# EAGLE design fdcanusb (EAGLE 9.6.0)
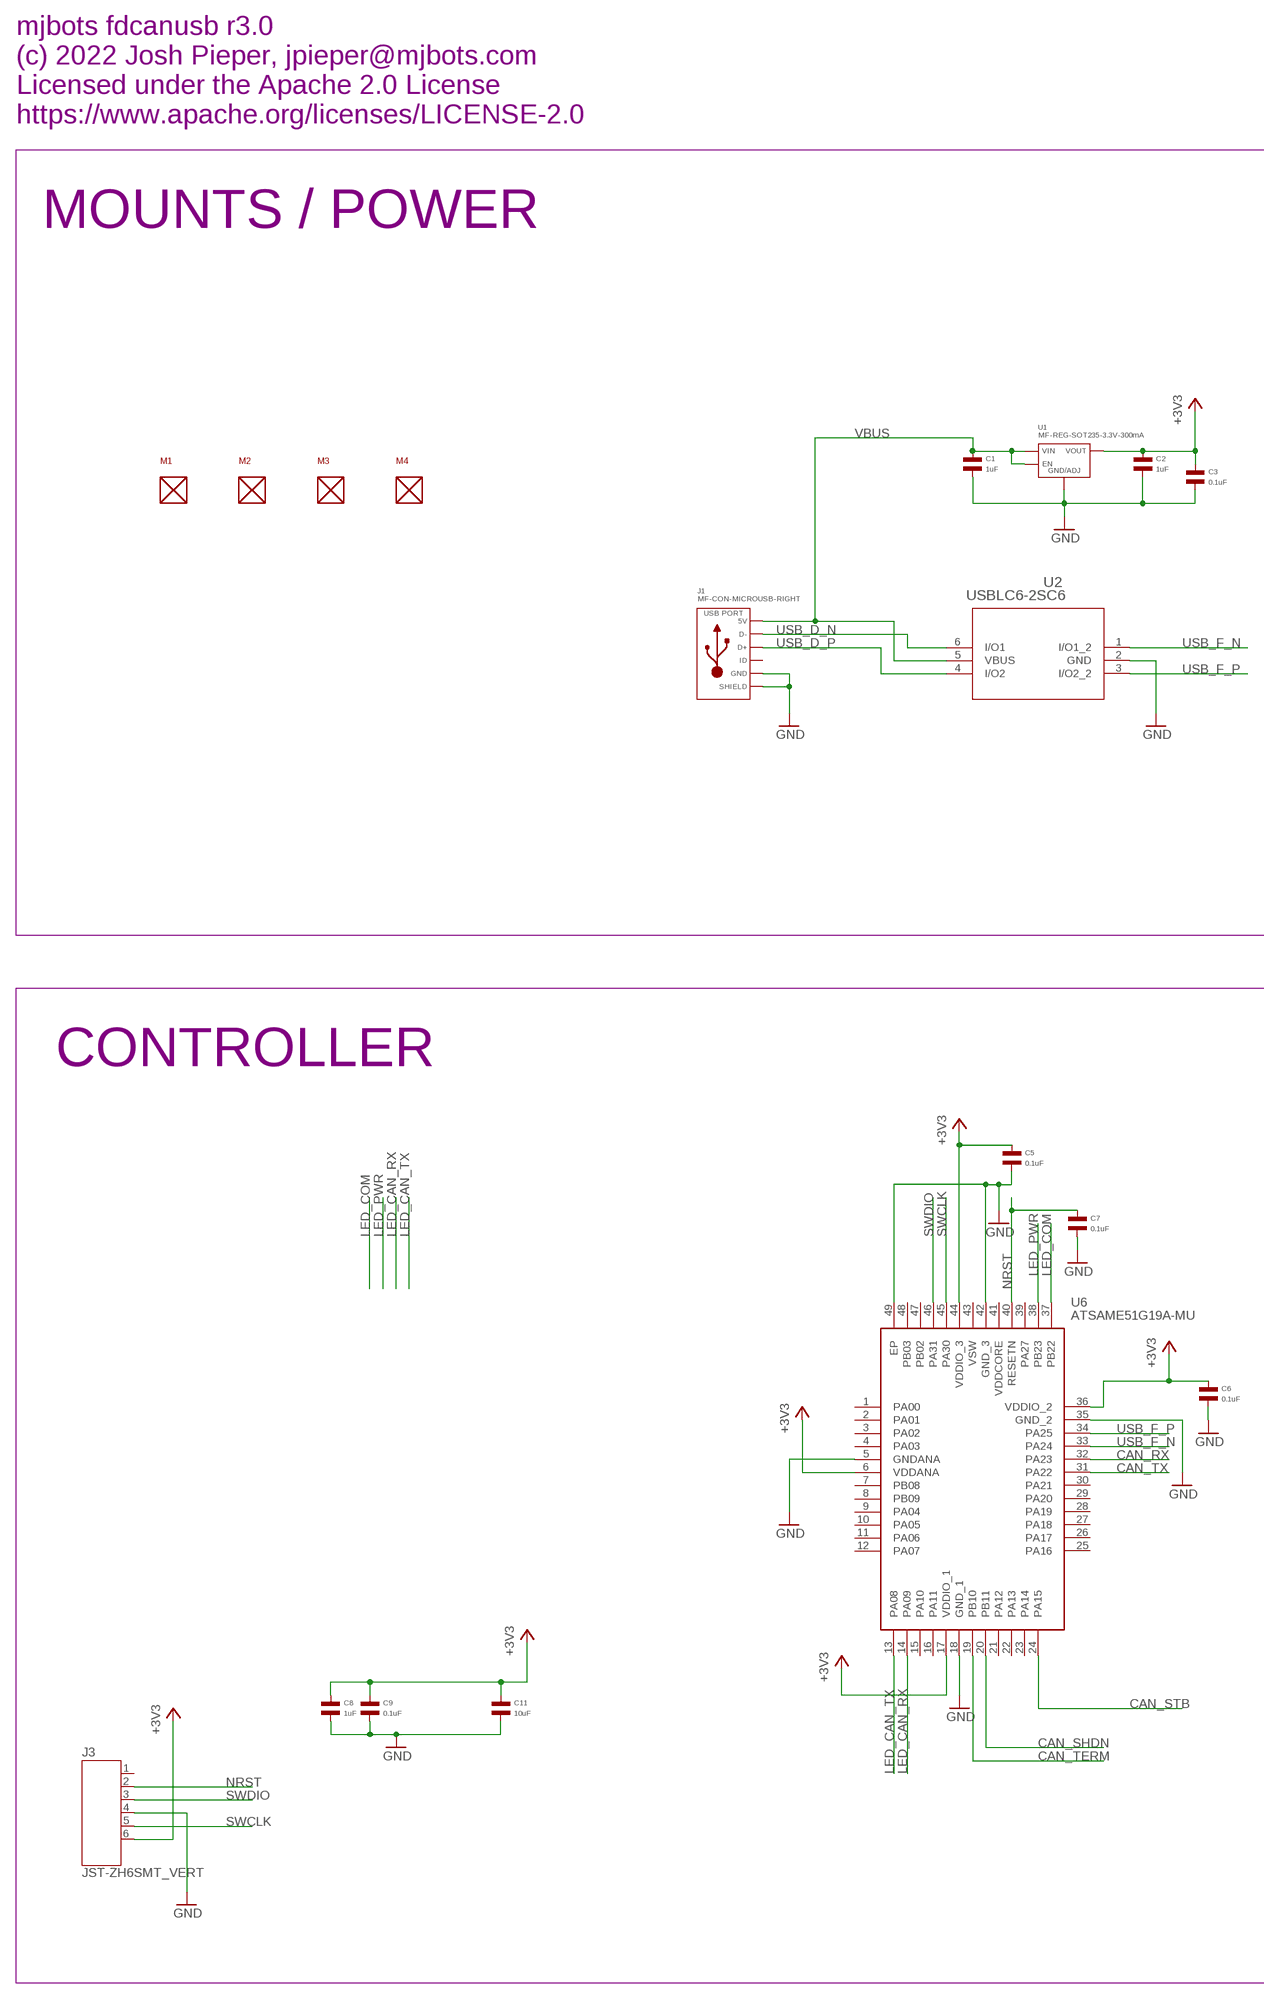
[diagram p0: schematic, sheet 1, part 1 of 2]
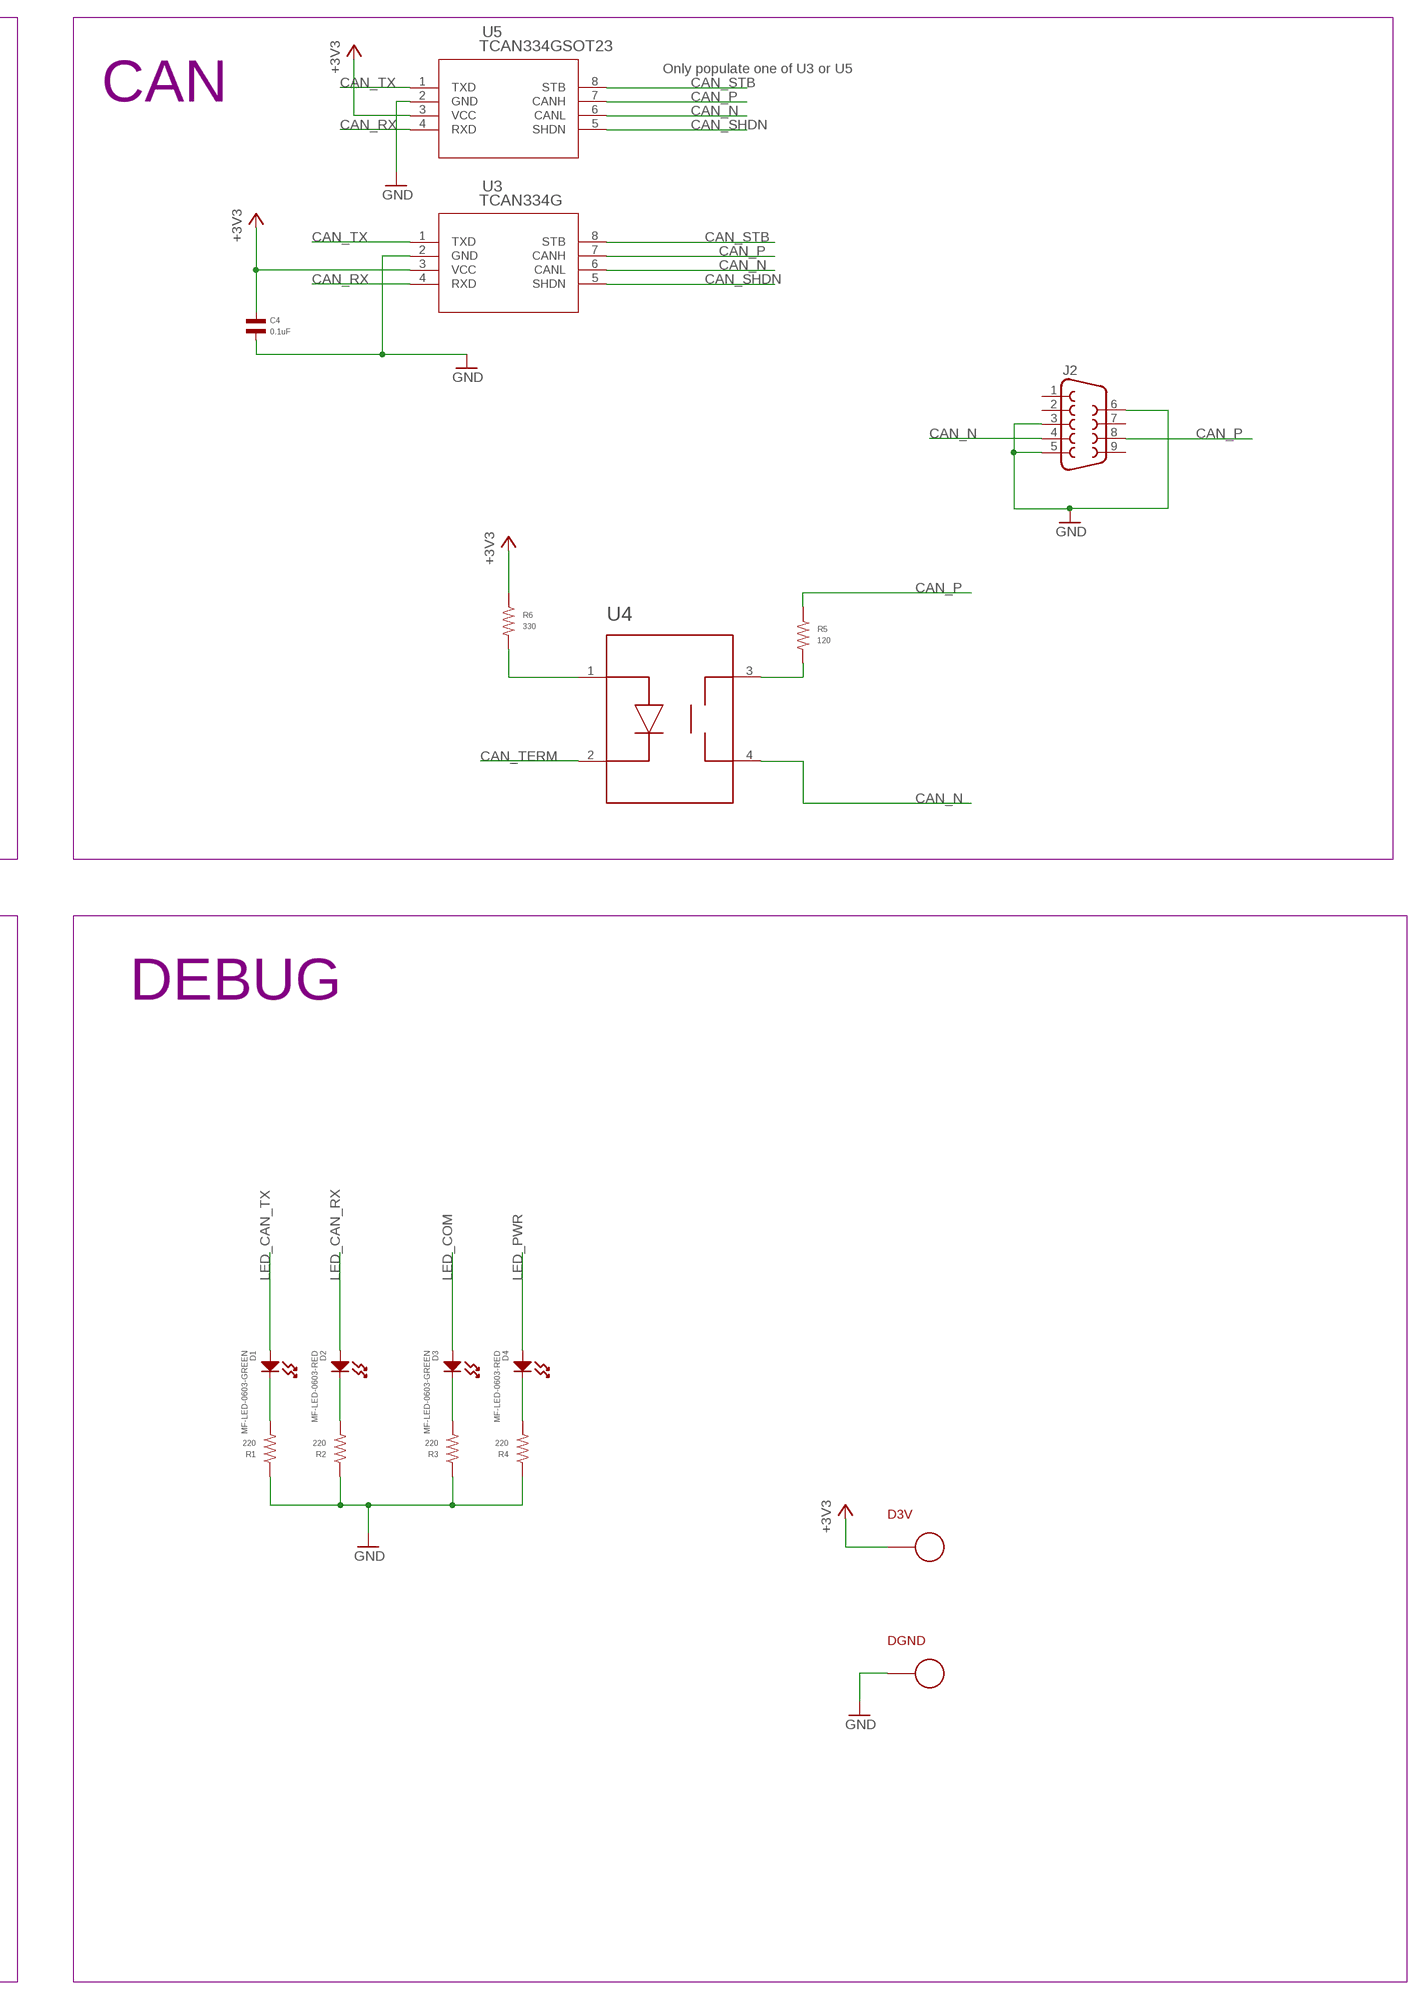
[diagram p1: schematic, sheet 1, part 2 of 2]

## Parts
C1  1uF  CAPACITOR_NP_0603  [C0603]
C2  1uF  CAPACITOR_NP_0603  [C0603]
C3  0.1uF  CAPACITOR_NP_0603  [C0603]
C4  0.1uF  CAPACITOR_NP_0603  [C0603]
C5  0.1uF  CAPACITOR_NP_0603  [C0603]
C6  0.1uF  CAPACITOR_NP_0603  [C0603]
C7  0.1uF  CAPACITOR_NP_0603  [C0603]
C8  1uF  CAPACITOR_NP_0603  [C0603]
C9  0.1uF  CAPACITOR_NP_0603  [C0603]
C11  10uF  CAPACITOR_NP_1206  [C1206]
D1  MF-LED-0603-GREEN  LED_SINGLE-0603-GREEN  [LED0603]
D2  MF-LED-0603-RED  LED_SINGLE-0603-RED  [LED0603]
D3  MF-LED-0603-GREEN  LED_SINGLE-0603-GREEN  [LED0603]
D3V  PAD24AWG_PAD  [24AWG_PAD]
D4  MF-LED-0603-RED  LED_SINGLE-0603-RED  [LED0603]
DGND  PAD24AWG_PAD  [24AWG_PAD]
J1  MF-CON-MICROUSB-RIGHT  USB_MICRO_RIGHT  [MICROUSB-RIGHT]
J2  F09  [DB09_PLATED]
J3  JST-ZH6SMT_VERT  [JST_B6B-ZR-SM4-TF(LF)(SN)]
M1  MOUNT  [M2.5MOUNT]
M2  MOUNT  [M2.5MOUNT]
M3  MOUNT  [M2.5MOUNT]
M4  MOUNT  [M2.5MOUNT]
R1  220  RESISTOR_0603  [R0603]
R2  220  RESISTOR_0603  [R0603]
R3  220  RESISTOR_0603  [R0603]
R4  220  RESISTOR_0603  [R0603]
R5  120  RESISTOR_0603  [R0603]
R6  330  RESISTOR_0603  [R0603]
U1  MF-REG-SOT235-3.3V-300mA  TLV70233PDBVR  [SOT-23-5]
U2  USBLC6-2SC6  [SOT23-6L]
U3  TCAN334G  [SOIC8]
U4  TLP3317  [TLP3317]
U5  TCAN334GSOT23  [SOT23-8]
U6  ATSAME51G19A-MU  [QFN50P700X700X90-49N]

## Nets
+3V3: C2.P$1 C3.P$1 C4.P$1 C5.P$1 C6.P$1 C8.P$1 C9.P$1 C11.P$1 D3V.P$1 J3.6 R6.P$1 U1.P$5(VOUT) U3.3(VCC) U5.3(VCC) U6.6(VDDANA) U6.17(VDDIO_1) U6.36(VDDIO_2) U6.44(VDDIO_3)
CAN_N [can]: J2.4 U3.6(CANL) U4.4(SW2) U5.6(CANL)
CAN_P [can]: J2.8 R5.P$1 U3.7(CANH) U5.7(CANH)
CAN_RX: U3.4(RXD) U5.4(RXD) U6.32(PA23)
CAN_SHDN: U3.5(SHDN) U5.5(SHDN) U6.20(PB11)
CAN_STB: U3.8(STB) U5.8(STB) U6.24(PA15)
CAN_TERM: U4.2(CATHODE) U6.19(PB10)
CAN_TX: U3.1(TXD) U5.1(TXD) U6.31(PA22)
GND: C1.P$2 C2.P$2 C3.P$2 C4.P$2 C5.P$2 C6.P$2 C7.P$2 C8.P$2 C9.P$2 C11.P$2 DGND.P$1 J1.5(GND) J1.S1(SLD) J1.S2(SLD) J1.S3(SLD) J1.S4(SLD) J1.S5(SLD) J1.S6(SLD) J2.3 J2.5 J2.6 J3.4 R1.P$1 R2.P$1 R3.P$1 R4.P$1 U1.P$2(GND/ADJ) U2.2(GND) U3.2(GND) U5.2(GND) U6.5(GNDANA) U6.18(GND_1) U6.35(GND_2) U6.42(GND_3) U6.49(EP)
LED_CAN_RX: D2.ANODE U6.14(PA09)
LED_CAN_TX: D1.ANODE U6.13(PA08)
LED_COM: D3.ANODE U6.37(PB22)
LED_PWR: D4.ANODE U6.38(PB23)
N$3: D1.CATHODE R1.P$2
N$4: D2.CATHODE R2.P$2
N$5: D3.CATHODE R3.P$2
N$6: D4.CATHODE R4.P$2
N$7: R5.P$2 U4.3(SW1)
N$8: R6.P$2 U4.1(ANODE)
NRST: C7.P$1 J3.2 U6.40(RESETN)
SWCLK: J3.5 U6.45(PA30)
SWDIO: J3.3 U6.46(PA31)
USB_D_N [usb]: J1.2(D-) U2.6(I/O1)
USB_D_P [usb]: J1.3(D+) U2.4(I/O2)
USB_F_N [usb]: U2.1(I/O1_2) U6.33(PA24)
USB_F_P [usb]: U2.3(I/O2_2) U6.34(PA25)
VBUS: C1.P$1 J1.1(5V) U1.P$1(VIN) U1.P$3(EN) U2.5(VBUS)
Unconnected: J1.4(ID) J2.1 J2.2 J2.7 J2.9 J3.1 U6.1(PA00) U6.2(PA01) U6.3(PA02) U6.4(PA03) U6.7(PB08) U6.8(PB09) U6.9(PA04) U6.10(PA05) U6.11(PA06) U6.12(PA07) U6.15(PA10) U6.16(PA11) U6.21(PA12) U6.22(PA13) U6.23(PA14) U6.25(PA16) U6.26(PA17) U6.27(PA18) U6.28(PA19) U6.29(PA20) U6.30(PA21) U6.39(PA27) U6.41(VDDCORE) U6.43(VSW) U6.47(PB02) U6.48(PB03)

## Notes on the sheet
- mjbots fdcanusb r3.0
  (c) 2022 Josh Pieper, jpieper@mjbots.com
  Licensed under the Apache 2.0 License
  https://www.apache.org/licenses/LICENSE-2.0
- Only populate one of U3 or U5
- MOUNTS / POWER | CAN
- CONTROLLER | DEBUG

## Library data of the parts
C1 C2 C8 = mfpassives:CAPACITOR_NP: Library: MF_Passives Description: Device for Non-Polarized Capacitors. Manufacture part number (MPN) can be added via Attributes. Check https://factory.macrofab.com/parts for the house parts list.; HOUSEPART: YES; MPN: MF-CAP-0603-1uF; POPULATE: 1
C3-C7 C9 = mfpassives:CAPACITOR_NP: Library: MF_Passives Description: Device for Non-Polarized Capacitors. Manufacture part number (MPN) can be added via Attributes. Check https://factory.macrofab.com/parts for the house parts list.; HOUSEPART: YES; MPN: MF-CAP-0603-0.1uF; POPULATE: 1
C11 = mfpassives:CAPACITOR_NP: Library: MF_Passives Description: Device for Non-Polarized Capacitors. Manufacture part number (MPN) can be added via Attributes. Check https://factory.macrofab.com/parts for the house parts list.; HOUSEPART: YES; MPN: MF-CAP-1206-10uF; POPULATE: 1
D1 D3 = mfleds:LED_SINGLE: Library: MF_LEDs Description: Device for Single LED Packages. Manufacture part number (MFG#) can be added via Attributes.; HOUSEPART: YES; MPN: MF-LED-0603-GREEN; POPULATE: 1; URL: https://factory.macrofab.com/part/MF-LED-0603-GREEN
D2 D4 = mfleds:LED_SINGLE: Library: MF_LEDs Description: Device for Single LED Packages. Manufacture part number (MFG#) can be added via Attributes.; HOUSEPART: YES; MPN: MF-LED-0603-RED; POPULATE: 1; URL: https://factory.macrofab.com/part/MF-LED-0603-RED
D3V DGND = fdcanusb:PAD; POPULATE: 0
J1 = mfconnectors:USB: Library: MF_Connectors Description: 5 Pin USB Connectors. SLD is the shield connection. Usually tied to ground through a small ferrite bead.; HOUSEPART: YES; MPN: MF-CON-MICROUSB-RIGHT; POPULATE: 1; URL: https://factory.macrofab.com/part/MF-CON-MICROUSB-RIGHT
J2 = fdcanusb:F09: SUB-D; POPULATE: 1
J3 = fdcanusb:JST-ZH6; MF: JST; MPN: B6B-ZR-SM4-TF(LF)(SN); POPULATE: 1
M1-M4 = fdcanusb:MOUNT; POPULATE: 0
R1-R4 = mfpassives:RESISTOR: Library: MF_Passives Description: Device for Resistors. Manufacture part number (MPN), Voltage, Tolerance, and Wattage Rating can be added via Attributes. Check https://factory.macrofab.com/parts for the house parts list.; HOUSEPART: YES; MPN: MF-RES-0603-220; POPULATE: 1
R5 = mfpassives:RESISTOR: Library: MF_Passives Description: Device for Resistors. Manufacture part number (MPN), Voltage, Tolerance, and Wattage Rating can be added via Attributes. Check https://factory.macrofab.com/parts for the house parts list.; MF: YAGEO; MPN: RC0603FR-07120RL; POPULATE: 1
R6 = mfpassives:RESISTOR: Library: MF_Passives Description: Device for Resistors. Manufacture part number (MPN), Voltage, Tolerance, and Wattage Rating can be added via Attributes. Check https://factory.macrofab.com/parts for the house parts list.; HOUSEPART: YES; MPN: MF-RES-0603-330; POPULATE: 1
U1 = mficpower:TLV702: Manufacturer Part #: TLV702 Manufacturer: Texas Instruments Description: LDO Voltage Regulators; HOUSEPART: YES; MPN: MF-REG-SOT235-3.3V-300mA; POPULATE: 1; URL: https://factory.macrofab.com/part/MF-REG-SOT235-3.3V-300mA
U2 = fdcanusb:USBLC6-2SC6; MANUFACTURER_PART_NUMBER: USBLC62SC6; MF: ST; MPN: USBLC6-2SC6; POPULATE: 1; VENDOR: STMicroelectronics
U3 = fdcanusb:TCAN334G; MF: TI; MPN: TCAN330GDR; POPULATE: 1
U4 = fdcanusb:TLP3317; MF: TOSHIBA; MPN: TLP3317; POPULATE: 1
U5 = fdcanusb:TCAN334G; MF: TI; MPN: TCAN334GDCNT; POPULATE: 0
U6 = ATSAME51G19A-MU:ATSAME51G19A-MU: ARM Microcontrollers - MCU 120MHZ 512KB Flash 48 QFN PKG CAN inTray 85CTemp Source: Datasheet <https://ww1.microchip.com/downloads/en/DeviceDoc/SAM_D5xE5x_Family_Data_Sheet_DS60001507F.pdf>; DESCRIPTION: ARM Microcontrollers - MCU 120MHZ 512KB Flash 48 QFN PKG CAN inTray 85CTemp; HEIGHT: 0.9mm; MANUFACTURER_NAME: Microchip; MANUFACTURER_PART_NUMBER: ATSAME51G19A-MU; MOUSER_PART_NUMBER: 556-ATSAME51G19A-MU; MOUSER_PRICE-STOCK: https://www.mouser.co.uk/ProductDetail/Microchip-Technology-Atmel/ATSAME51G19A-MU?qs=T3oQrply3y9rgmlDkX5Sew%3D%3D

## Net classes
1 usb: width 0.305 mm, clearance 0.152 mm
2 can: width 0.216 mm, clearance 0.152 mm

## Board
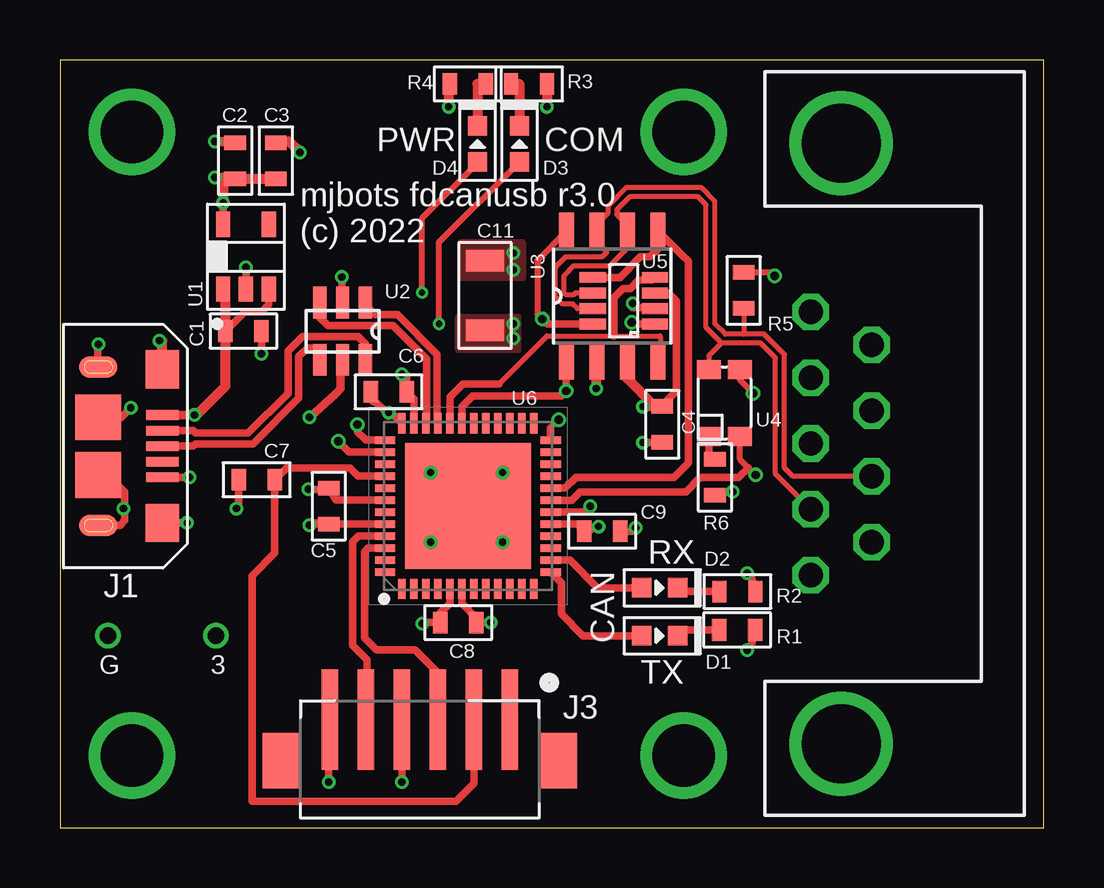
[diagram p2: board, top side]
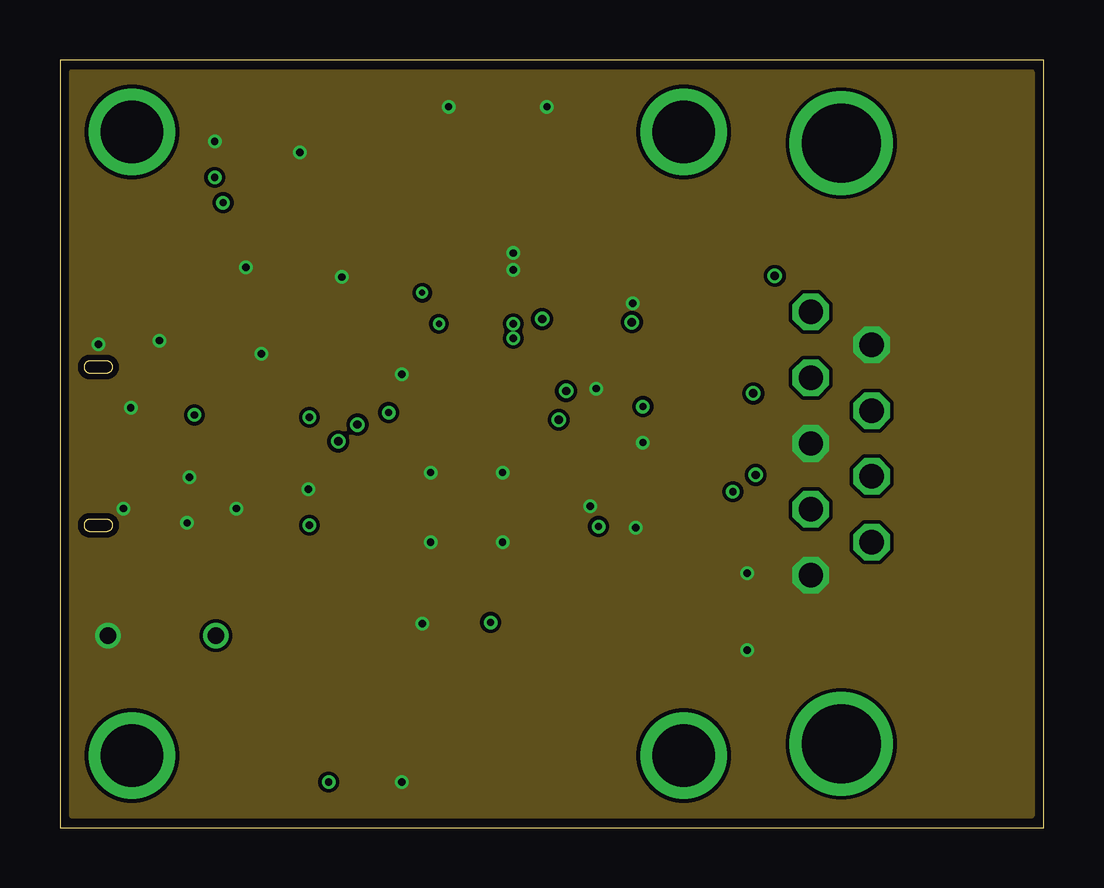
[diagram p3: board, inner layer Route2]
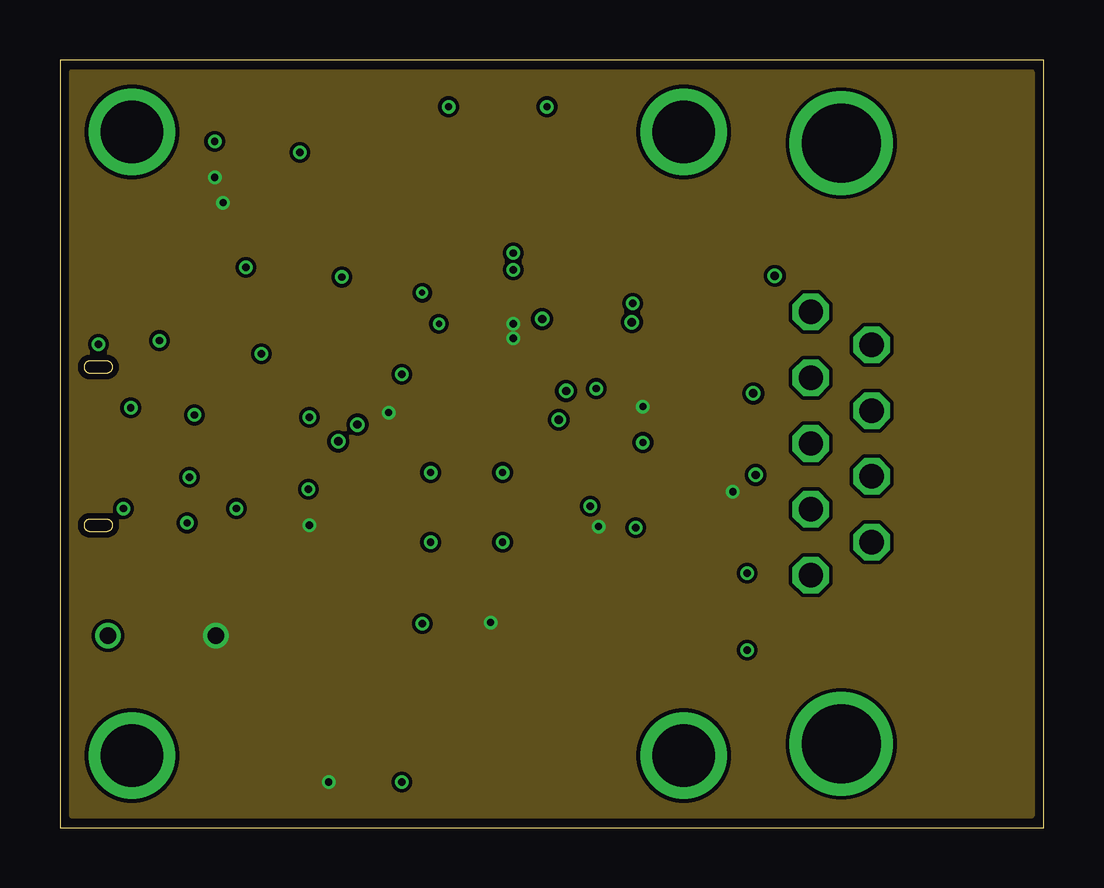
[diagram p4: board, inner layer Route15]
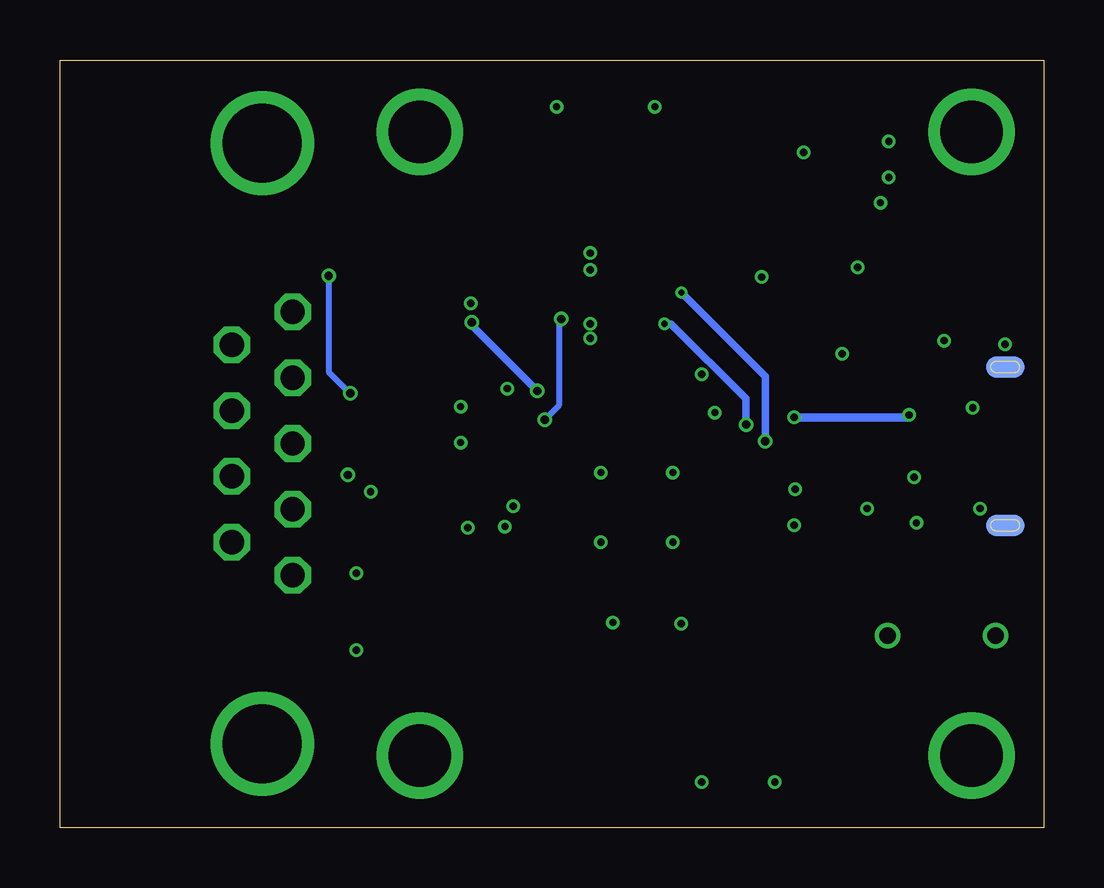
[diagram p5: board, bottom side, seen from below]

Size 41 x 32 mm. Coordinates in mm from the lower left corner, seen from the top.
Outline: 0,0 41,0 41,32 0,32 0,0
Copper layers (1*2*15*16): Top 0.035mm / dielectric 0.23mm / Route2 0.035mm / dielectric 0.93mm / Route15 0.035mm / dielectric 0.23mm / Bottom 0.035mm
Design rules "MF_Standard_4_Layer *": minimum track width 6mil, minimum drill 10mil, track to track 6mil, track to pad 6mil, pad to pad 6mil, via to via 6mil, smd to smd 0mil, copper to edge 10mil, drill to drill 10mil, minimum pad ring 5mil, minimum via ring 5mil, stop-mask expansion 2mil, vias tented up to drill 25mil, thermal gap 10mil

### Footprints (pad centres in the part's own frame; a part is rotated, then mirrored left to right if it is on the bottom)
C0603 = smd 0.6 x 0.9: P$1 -0.75,0; P$2 0.75,0
C1206 = smd 0.9 x 1.6: P$1 -1.45,0; P$2 1.45,0
LED0603 = smd 0.8 x 0.8: ANODE 0.75,0; CATHODE -0.75,0
24AWG_PAD = drill 0.7: P$1 0,0
MICROUSB-RIGHT = smd 0.4 x 1.35: 1 -1.3,1.27; 2 -0.65,1.27; 3 0,1.27; 4 0.65,1.27; 5 1.3,1.27 | smd 0.9 x 1.6: S1 -3.3,-1.4; S2 3.3,-1.4 | smd 1.6 x 1.4: S3 -3.2,1.27; S4 3.2,1.27 | smd 1.9 x 1.9: S5 -1.2,-1.405; S6 1.2,-1.405 | smd 0.9 x 1.6 bottom: S7 -3.3,-1.4; S8 3.3,-1.4
DB09_PLATED = drill 1.016 octagon: 1 -5.486,-1.27; 2 -2.743,-1.27; 3 0,-1.27; 4 2.743,-1.27; 5 5.486,-1.27; 6 -4.115,1.27; 7 -1.372,1.27; 8 1.372,1.27; 9 4.115,1.27 | drill 3.302: S1 -12.522,0; S2 12.522,0
JST_B6B-ZR-SM4-TF(LF)(SN) = smd 0.7 x 4.2: 1 -3.75,-2; 2 -2.25,-2; 3 -0.75,-2; 4 0.75,-2; 5 2.25,-2; 6 3.75,-2 | smd 1.5 x 2.3: P1 -5.8,-0.29; P2 5.8,-0.29
M2.5MOUNT = drill 2.6: P$1 0,0
R0603 = smd 0.6 x 0.9: P$1 -0.75,0; P$2 0.75,0
SOT-23-5 = smd 1.05 x 0.6: P$1 -1.35,0.95; P$2 -1.35,0; P$3 -1.35,-0.95; P$4 1.35,-0.95; P$5 1.35,0.95
SOT23-6L = smd 1.321 x 0.559: 1 -1.194,0.95; 2 -1.194,0; 3 -1.194,-0.95; 4 1.194,-0.95; 5 1.194,0; 6 1.194,0.95
SOIC8 = smd 1.549 x 0.61: 1 -2.7,1.905; 2 -2.7,0.635; 3 -2.7,-0.635; 4 -2.7,-1.905; 5 2.7,-1.905; 6 2.7,-0.635; 7 2.7,0.635; 8 2.7,1.905
TLP3317 = smd 1 x 0.8: 1 -0.65,-1.4; 2 0.65,-1.4; 3 0.65,1.4; 4 -0.65,1.4
SOT23-8 = smd 0.45 x 1.1: 1 -0.975,-1.3; 2 -0.325,-1.3; 3 0.325,-1.3; 4 0.975,-1.3; 5 0.975,1.3; 6 0.325,1.3; 7 -0.325,1.3; 8 -0.975,1.3
QFN50P700X700X90-49N = smd 0.85 x 0.3: 1 -3.45,2.75; 2 -3.45,2.25; 3 -3.45,1.75; 4 -3.45,1.25; 5 -3.45,0.75; 6 -3.45,0.25; 7 -3.45,-0.25; 8 -3.45,-0.75; 9 -3.45,-1.25; 10 -3.45,-1.75; 11 -3.45,-2.25; 12 -3.45,-2.75; 25 3.45,-2.75; 26 3.45,-2.25; 27 3.45,-1.75; 28 3.45,-1.25; 29 3.45,-0.75; 30 3.45,-0.25; 31 3.45,0.25; 32 3.45,0.75; 33 3.45,1.25; 34 3.45,1.75; 35 3.45,2.25; 36 3.45,2.75 | smd 0.3 x 0.85: 13 -2.75,-3.45; 14 -2.25,-3.45; 15 -1.75,-3.45; 16 -1.25,-3.45; 17 -0.75,-3.45; 18 -0.25,-3.45; 19 0.25,-3.45; 20 0.75,-3.45; 21 1.25,-3.45; 22 1.75,-3.45; 23 2.25,-3.45; 24 2.75,-3.45; 37 2.75,3.45; 38 2.25,3.45; 39 1.75,3.45; 40 1.25,3.45; 41 0.75,3.45; 42 0.25,3.45; 43 -0.25,3.45; 44 -0.75,3.45; 45 -1.25,3.45; 46 -1.75,3.45; 47 -2.25,3.45; 48 -2.75,3.45 | smd 5.25 x 5.25: 49 0,0

### Placement (x,y rotation side)
C1  7.65,20.7 0 top
C2  7.3,27.8 90 top
C3  9,27.8 90 top
C4  25.11,16.81 270 top
C5  11.2,13.4 90 top
C6  13.7,18.16 0 top
C7  8.2,14.5 180 top
C8  16.6,8.55 180 top
C9  22.6,12.35 0 top
C11  17.72,22.18 90 top
D1  25,8 180 top
D2  25,10 180 top
D3  19.15,28.5 270 top
D3V  6.5,8 0 top
D4  17.4,28.5 270 top
DGND  2,8 0 top
J1  3,15.9 270 top
J2  32.57,16.01 270 top
J3  15,2.5 180 top
M1  26,3 0 top
M2  26,29 0 top
M3  3,3 0 top
M4  3,29 0 top
R1  28.23,8.24 180 top
R2  28.24,9.84 180 top
R3  19.55,31 180 top
R4  17,31 0 top
R5  28.5,22.4 90 top
R6  27.3,14.6 90 top
U1  7.75,23.8 90 top
U2  11.78,20.69 270 top
U3  23.02,22.16 90 top
U4  27.7,17.7 0 top
U5  23.5,21.96 90 top
U6  17,13.4 90 top

### Tracks (layer width: path | path; a pad name or v marks a point on that pad's centre or on a via)
+3V3  (via drill 0.3)
  Top 0.305: U1.P$5 6.8,26 v6.8,26.05 | C2.P$1 v6.45,27.1 | C5.P$1 11.15,12.7 10.5,12.7 v10.4,12.6 10.45,12.65 U6.44 | J3.6 11.2,4.45 v11.2,1.9 | v17.95,8.55 C8.P$1 17.35,8.75 16.75,9.35 U6.6 | C4.P$1 25.11,17.61 25.7,18.2 25.7,21.94 25.36,22.29 U5.3 | R6.P$1 28,14.05 v28.05,14 | v22.45,12.55 22.25,12.55 22.05,12.35 C9.P$1 21.55,12.65 U6.17 | C6.P$1 12.95,17.86 13.04,17.77 13.06,17.85 13.61,17.3 v13.7,17.3 13.8,17.3 U6.36
  Top 0.406: C4.P$1 v24.3,17.55 | 6.8,26 6.8,27.1 C2.P$1 C3.P$1 | U3.3 23.66,18.71 24.81,17.56 C4.P$1
  other vias: 18.9,21 18.9,20.4
  pour Route15 (no thermals): 0.5,31.5 40.5,31.5 40.5,0.5 0.5,0.5
  pour Top (no thermals): 19.1,21.3 19.1,19.9 16.6,19.9 16.6,21.3
CAN_N
  Top 0.216: J2.4 29.83,14.73 29.83,19.57 29.2,20.2 27.58,20.2 | 27.58,20.2 26.93,20.85 26.93,25.97 26.6,26.3 23.75,26.3 23.21,25.76 23.21,25.55 23.66,25.11 U3.6 23.66,24.16 22.92,23.42 21.42,23.42 21,23 21,22.3 21.1,22.2 21.4,22.2 21.48,22.29 U5.6 | 27.58,20.2 27.05,19.67 U4.4
CAN_P
  Top 0.216: 28.5,20.57 29.35,20.57 30.2,19.72 30.2,15 30.56,14.64 J2.8 | 28.5,20.57 27.73,20.57 27.3,21 27.3,26.12 26.75,26.67 23.59,26.67 22.84,25.92 22.84,25.61 22.39,25.16 U3.7 22.39,24.41 22.8,24 22.59,23.79 21.07,23.79 20.63,23.35 20.63,22.15 20.95,21.83 21.37,21.83 21.57,21.64 U5.7 | R5.P$1 28.5,20.57
CAN_RX
  Top 0.216: 18.3,18.5 20.3,20.5 23.1,20.5 25.02,20.5 25.02,20.08
  Top 0.305: U6.32 16.25,17.95 16.8,18.5 18.3,18.5 | U3.4 25.02,19.56 25.02,20.08 | U5.4 24.68,22.82 24.12,22.82 23.79,22.48 23.48,22.48 23.1,22.1 23.1,20.5
CAN_SHDN
  Top 0.305: U6.20 21.05,14.15 21.51,14.6 25.6,14.6 26.2,15.2 26.2,23.61 25.9,23.89 U3.5 24.93,24.12 24.6,23.8 24.2,23.8 23.34,22.93 U5.5
CAN_STB  (via drill 0.35)
  Top 0.254: 20.45,16.65 v20.8,17 | v20.1,21.2 19.9,21.4 19.9,23.64 U3.8
  Top 0.305: U6.24 20.45,16.65 | U5.8 20.32,20.98 v20.1,21.2
  Bottom 0.254: v20.1,21.2 20.2,21.1 20.2,17.6 v20.8,17
CAN_TERM  (via drill 0.35)
  Top 0.254: v29,14.7 28.7,15 28.35,15.35 U4.2
  Top 0.305: U6.19 21.32,13.64 21.68,14 26.1,14 26.68,14.58 28.28,14.58 28.7,15
CAN_TX  (via drill 0.35)
  Top 0.305: U6.31 16.75,17.55 17.2,18 20.9,18 v21.1,18.2 21.1,19.45 U3.1 21.11,19.16 | v23.84,21.07 23.93,20.98 U5.1
  Bottom 0.305: v21.1,18.2 23.84,20.94 v23.84,21.07
GND  (via drill 0.3)
  Top 0.305: J1.5 v5.4,14.6 | J1.S1 1.57,19.98 v1.6,20.15 | C1.P$2 v8.4,19.75 | U1.P$2 v7.75,23.35 | v10.35,14.1 11.25,14.1 11.2,14.05 11.2,14.06 C5.P$2 11.5,13.65 U6.42 | v14.25,18.9 14.45,18.86 C6.P$2 14.75,17.86 U6.35 | J3.4 v14.25,1.9 | C7.P$2 7.45,13.4 v7.35,13.3 | v28.65,10.6 28.82,10.43 R2.P$1 | R1.P$1 28.8,7.55 v28.65,7.4 | v15.1,8.5 15.15,8.55 C8.P$2 15.85,8.95 16.25,9.35 U6.5 | v24,12.5 23.85,12.35 C9.P$2 | v24.3,16.05 v24.31,16.06 C4.P$2 | U2.2 11.75,21.91 v11.75,22.95 | v2.95,17.5 2.55,17.1 J1.S5 | J1.S2 2.5,12.6 2.7,12.8 2.7,13.25 v2.65,13.3 2.69,13.35 2.69,14 2,14.7 J1.S6 | v5.3,12.7 J1.S4 | U6.18 21.85,13.15 v22.1,13.4 | U6.49 17.05,13.4 v18.45,14.8 | v23.87,21.85 23.87,21.68 24.76,21.68 U5.2
  Top 0.406: C2.P$2 v6.45,28.6 | C3.P$2 9.55,28.6 v10,28.15 | R4.P$1 16.2,31 v16.2,30.05 | R3.P$1 v20.3,30.05 | J1.S3 4.27,20.3 v4.15,20.3 | U3.2 22.35,19.43 v22.35,18.3
  other vias: 18.9,23.25 18.9,23.95 15.45,14.8 18.45,11.9 15.45,11.9
  pour Route2 (no thermals): 0.5,31.5 40.5,31.5 40.5,0.5 0.5,0.5
  pour Top (no thermals): 19.3,24.4 19.3,22.9 16.7,22.9 16.7,24.4
LED_CAN_RX
  Top 0.305: U6.14 21.25,11.15 22.4,10 D2.ANODE
LED_CAN_TX
  Top 0.305: U6.13 20.9,10.2 20.9,8.9 21.8,8 D1.ANODE
LED_COM  (via drill 0.25, 0.35)
  Top 0.254: D3.ANODE 15.8,24.4 v15.8,21
  Top 0.305: U6.37 12.75,16.15 12.4,16.5 v12.4,16.8
  Bottom 0.305: v15.8,21 15.52,21 12.4,17.88 v12.4,16.8
LED_PWR  (via drill 0.25, 0.35)
  Top 0.254: v15.1,22.3 15.1,25.4 17.4,27.7 D4.ANODE
  Top 0.305: U6.38 12.05,15.65 v11.6,16.1
  Bottom 0.305: v11.6,16.1 11.6,18.8 v15.1,22.3
N$3
  Top 0.305: R1.P$2 25.99,8.24 D1.CATHODE
N$4
  Top 0.305: R2.P$2 25.91,9.84 D2.CATHODE
N$5
  Top 0.406: R3.P$2 19.15,31 D3.CATHODE
N$6
  Top 0.406: R4.P$2 17.4,31 D4.CATHODE
N$7  (via drill 0.35)
  Top 0.254: R5.P$2 29.74,23.15 29.77,23.03 v29.8,23 | v28.9,18.1 28.35,18.65 U4.3
  Bottom 0.254: v29.8,23 29.8,19 v28.9,18.1
N$8
  Top 0.305: U4.1 27.05,15.4 R6.P$2
NRST
  Top 0.305: J3.2 17.25,1.85 16.5,1.1 8,1.1 8,10.5 8.95,11.45 C7.P$1 9.45,15 12.09,15 12.43,14.66 13.54,14.66 U6.40
SWCLK
  Top 0.305: U6.45 12.45,12.15 12.2,11.9 12.2,7.6 12.8,7 12.8,4.55 J3.5
SWDIO
  Top 0.305: U6.46 12.85,11.65 12.7,11.5 12.7,7.9 13.2,7.4 14.8,7.4 15.8,6.4 15.8,4.55 J3.3
USB_D_N
  Top 0.305: J1.2 5.55,16.55 5.65,16.45 7.85,16.45 9.5,18.1 9.5,19.86 10.11,20.46 12.42,20.46 12.73,20.15 U2.6
USB_D_P
  Top 0.305: U2.4 10.83,19.95 10.79,19.99 10.32,19.99 9.96,19.63 9.96,17.91 8.04,16 5.65,16 5.55,15.9 J1.3
USB_F_N
  Top 0.305: U2.1 12.74,21.77 13.14,21.38 14.07,21.38 15.73,19.72 15.73,16.87 U6.33
USB_F_P
  Top 0.305: U2.3 10.83,21.27 11.18,20.92 13.88,20.92 15.27,19.53 15.27,16.87 U6.34
VBUS  (via drill 0.3)
  Top 0.305: U1.P$3 8.7,21.8 8.4,21.5 7.7,21.5 C1.P$1
  Top 0.356: J1.1 v5.6,17.2 | U2.5 11.7,19.42 11.7,18.3 11.5,18.1 v10.4,17.1
  Top 0.406: v5.6,17.2 5.7,17.2 6.9,18.4 C1.P$1 6.9,22.35 U1.P$1
  Bottom 0.356: v10.4,17.1 5.7,17.1 v5.6,17.2

### Text on the board
tPlace: PWR | COM | mjbots fdcanusb r3.0 / (c) 2022 | RX | CAN | G | 3 | TX